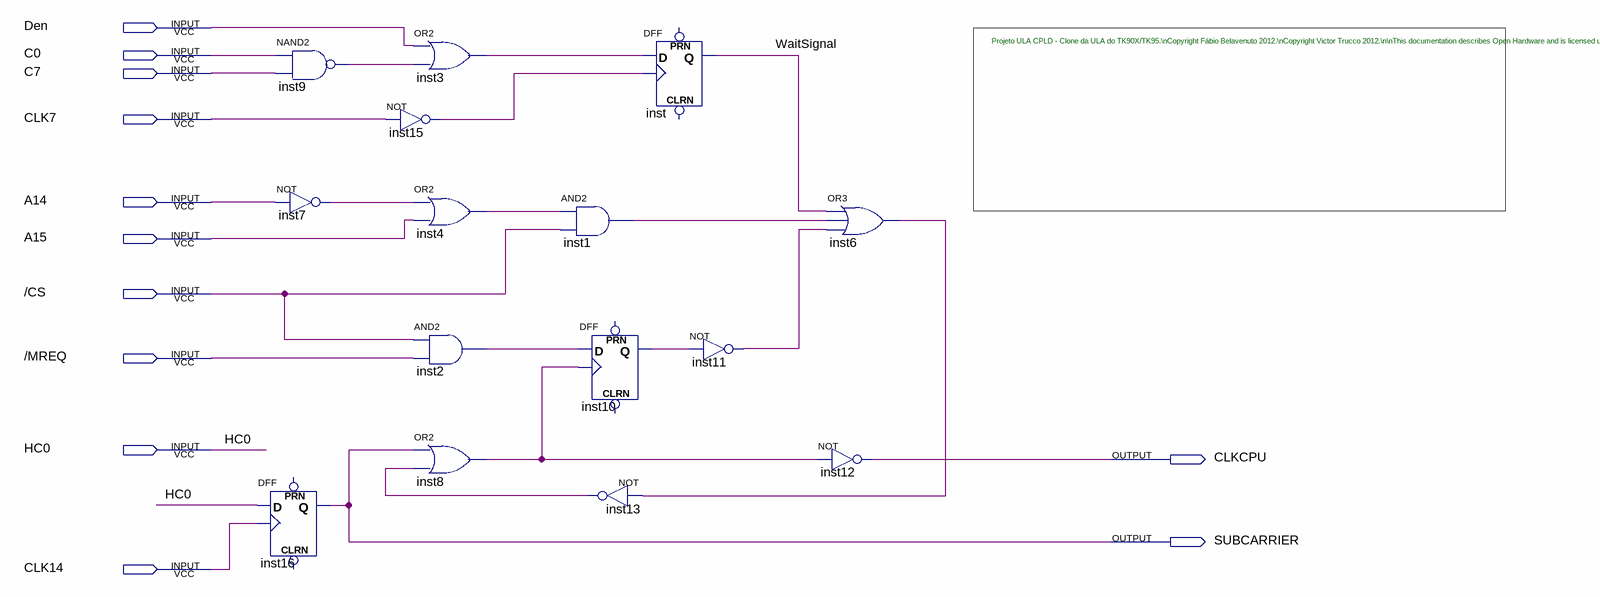
[diagram p0: schematic sheet]
// Quartus schematic Wait_Subcarrier.bdf as structural Verilog: 15 symbols, 12 pins
module Wait_Subcarrier (
  input  Den,
  input  C0,
  input  C7,
  input  CLK7,
  input  A14,
  input  A15,
  input  \/CS ,
  input  \/MREQ ,
  input  HC0,
  input  CLK14,
  output CLKCPU,
  output SUBCARRIER
);

  wire inst1_out, inst2_out, inst3_out, inst4_out, inst6_out, inst7_out, inst8_out, inst9_out, inst10_q,
       inst11_out, inst13_out, inst15_out, WaitSignal;

  nand inst9 (inst9_out, C0, C7);
  not inst7 (inst7_out, A14);
  DFF inst16 (.CLK(CLK14), .D(HC0), .Q(SUBCARRIER));  // open: CLRN, PRN
  or inst3 (inst3_out, Den, inst9_out);
  not inst15 (inst15_out, CLK7);
  or inst4 (inst4_out, inst7_out, A15);
  and inst2 (inst2_out, \/CS , \/MREQ );
  or inst8 (inst8_out, SUBCARRIER, inst13_out);
  and inst1 (inst1_out, inst4_out, \/CS );
  DFF inst10 (.CLK(inst8_out), .D(inst2_out), .Q(inst10_q));  // open: CLRN, PRN
  DFF inst (.CLK(inst15_out), .D(inst3_out), .Q(WaitSignal));  // open: CLRN, PRN
  not inst13 (inst13_out, inst6_out);
  not inst11 (inst11_out, inst10_q);
  or inst6 (inst6_out, WaitSignal, inst1_out, inst11_out);
  not inst12 (CLKCPU, inst8_out);

  // Notes on the sheet:
  //   Projeto ULA CPLD - Clone da ULA do TK90X/TK95.\nCopyright Fábio Belavenuto 2012.\nCopyright Victor Trucco 2012.\n\nThis documentation describes Open Hardware and is licensed under the CERN OHL v. 1.1.\nYou may redistribute and modify this documentation under the terms of the\nCERN OHL v.1.1. (http://ohwr.org/cernohl). This documentation is distributed\nWITHOUT ANY EXPRESS OR IMPLIED WARRANTY, INCLUDING OF MERCHANTABILITY,\nSATISFACTORY QUALITY AND FITNESS FOR A PARTICULAR PURPOSE.\nPlease see the CERN OHL v.1.1 for applicable conditions
endmodule
